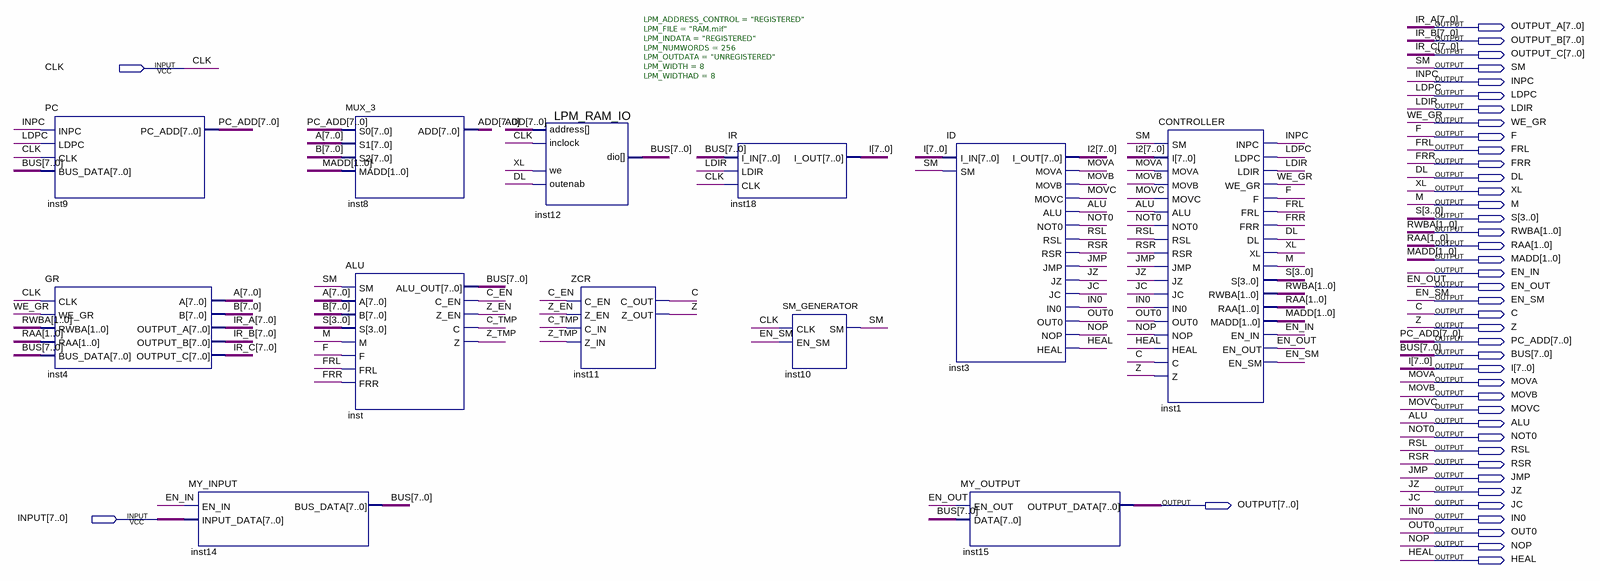
[diagram p0: schematic sheet]
// Quartus schematic CPU.bdf as structural Verilog: 12 symbols, 43 pins
module CPU (
  input  CLK,
  input  [7:0] INPUT,
  output [7:0] OUTPUT_A,
  output [7:0] OUTPUT_B,
  output [7:0] OUTPUT_C,
  output SM,
  output INPC,
  output LDPC,
  output LDIR,
  output WE_GR,
  output F,
  output FRL,
  output FRR,
  output DL,
  output XL,
  output M,
  output [3:0] S,
  output [1:0] RWBA,
  output [1:0] RAA,
  output [1:0] MADD,
  output EN_IN,
  output EN_OUT,
  output EN_SM,
  output C,
  output Z,
  output [7:0] PC_ADD,
  output [7:0] BUS,
  output [7:0] I,
  output MOVA,
  output MOVB,
  output MOVC,
  output ALU,
  output NOT0,
  output RSL,
  output RSR,
  output JMP,
  output JZ,
  output [7:0] OUTPUT,
  output JC,
  output IN0,
  output OUT0,
  output NOP,
  output HEAL
);

  wire C_EN, C_TMP, Z_EN, Z_TMP;
  wire [7:0] A, ADD, B, I2;

  PC inst9 (.INPC(INPC), .LDPC(LDPC), .CLK(CLK), .BUS_DATA(BUS), .PC_ADD(PC_ADD));
  GR inst4 (
    .CLK(CLK), .WE_GR(WE_GR), .RWBA(RWBA), .RAA(RAA), .BUS_DATA(BUS), .A(A), .B(B), .OUTPUT_A(OUTPUT_A),
    .OUTPUT_B(OUTPUT_B), .OUTPUT_C(OUTPUT_C));
  MY_INPUT inst14 (.EN_IN(EN_IN), .INPUT_DATA(INPUT), .BUS_DATA(BUS));
  MUX_3 inst8 (.S0(PC_ADD), .S1(A), .S2(B), .MADD(MADD), .ADD(ADD));
  ALU inst (
    .SM(SM), .A(A), .B(B), .S(S), .M(M), .F(F), .FRL(FRL), .FRR(FRR), .ALU_OUT(BUS), .C_EN(C_EN),
    .Z_EN(Z_EN), .C(C_TMP), .Z(Z_TMP));
  LPM_RAM_IO #(.LPM_ADDRESS_CONTROL("REGISTERED"), .LPM_FILE("RAM.mif"), .LPM_INDATA("REGISTERED"), .LPM_NUMWORDS(256), .LPM_OUTDATA("UNREGISTERED"), .LPM_WIDTH(8), .LPM_WIDTHAD(8)) inst12 (
    .address(ADD), .inclock(CLK), .we(XL), .outenab(DL), .dio(BUS));
  ZCR inst11 (.C_EN(C_EN), .Z_EN(Z_EN), .C_IN(C_TMP), .Z_IN(Z_TMP), .C_OUT(C), .Z_OUT(Z));
  IR inst18 (.I_IN(BUS), .LDIR(LDIR), .CLK(CLK), .I_OUT(I));
  SM_GENERATOR inst10 (.CLK(CLK), .EN_SM(EN_SM), .SM(SM));
  ID inst3 (
    .I_IN(I), .SM(SM), .I_OUT(I2), .MOVA(MOVA), .MOVB(MOVB), .MOVC(MOVC), .ALU(ALU), .NOT0(NOT0), .RSL(RSL),
    .RSR(RSR), .JMP(JMP), .JZ(JZ), .JC(JC), .IN0(IN0), .OUT0(OUT0), .NOP(NOP), .HEAL(HEAL));
  MY_OUTPUT inst15 (.EN_OUT(EN_OUT), .DATA(BUS), .OUTPUT_DATA(OUTPUT));
  CONTROLLER inst1 (
    .SM(SM), .I(I2), .MOVA(MOVA), .MOVB(MOVB), .MOVC(MOVC), .ALU(ALU), .NOT0(NOT0), .RSL(RSL), .RSR(RSR),
    .JMP(JMP), .JZ(JZ), .JC(JC), .IN0(IN0), .OUT0(OUT0), .NOP(NOP), .HEAL(HEAL), .C(C), .Z(Z), .INPC(INPC),
    .LDPC(LDPC), .LDIR(LDIR), .WE_GR(WE_GR), .F(F), .FRL(FRL), .FRR(FRR), .DL(DL), .XL(XL), .M(M), .S(S),
    .RWBA(RWBA), .RAA(RAA), .MADD(MADD), .EN_IN(EN_IN), .EN_OUT(EN_OUT), .EN_SM(EN_SM));

  // Other names for the same wires on the sheet: IR_A[7:0] = OUTPUT_A; IR_B[7:0] = OUTPUT_B; IR_C[7:0] = OUTPUT_C
endmodule
